# Altium schematic sheet DC_DC_3.3V.SchDoc
size A4
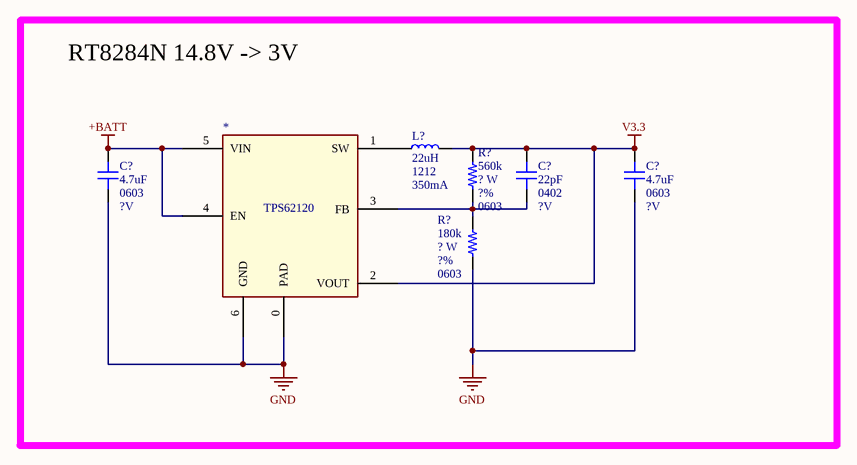
[diagram p0: DC_DC_3.3V.SchDoc]

## Parts
(Parts that share a designator on the sheet are numbered #1, #2 ... from top to bottom, then left to right.)
*  TPS62120  [DRV-6]  (value not drawn)
C?#1  value 4.7uF  Package: 0603  Voltage: ?V  [CAP_0603]  (hidden comment: CAP - 0603)
C?#2  value 22pF  Package: 0402  Voltage: ?V  [CAP_0402]  (hidden comment: CAP - 0402)
C?#3  value 4.7uF  Package: 0603  Voltage: ?V  [CAP_0603]  (hidden comment: CAP - 0603)
L?  value 22uH  Package: 1212  Current: 350mA  [IND 1212]  (hidden comment: IND)
R?#1  value 560k  Watt: ? W  Tolerance: ?%  Package: 0603  [RES_0603]  (hidden comment: RES - 0603)
R?#2  value 180k  Watt: ? W  Tolerance: ?%  Package: 0603  [RES_0603]  (hidden comment: RES - 0603)

## Blocks framed on the sheet
RT8284N 14.8V -> 3V: * C?#1-C?#3 L? R?#1 R?#2

## Nets
+BATT: *.4(EN) *.5(VIN) C?#1.2
GND: *.0(PAD) *.6(GND) C?#1.1 C?#3.1 R?#2.1
V3.3: *.2(VOUT) C?#2.1 C?#3.2 L?.2 R?#1.1
Net*_1: *.1(SW) L?.1
Net*_3: *.3(FB) C?#2.2 R?#1.2 R?#2.2

## Library data of the parts
C?#1 C?#3 = CAP - 0603: Part number: CL10A475MP5LNNC
C?#2 = CAP - 0402: Part number: 885012005009
L? = IND: Part number: LQH3NPN220MJRL
R?#1 = RES - 0603: Part number: MCT06030C5603FP500
R?#2 = RES - 0603: Part number: CRGCQ0603F180K
* = TPS62120: Part number: TPS62120